# EAGLE design SHASwitchOutput (EAGLE 6.5.0)
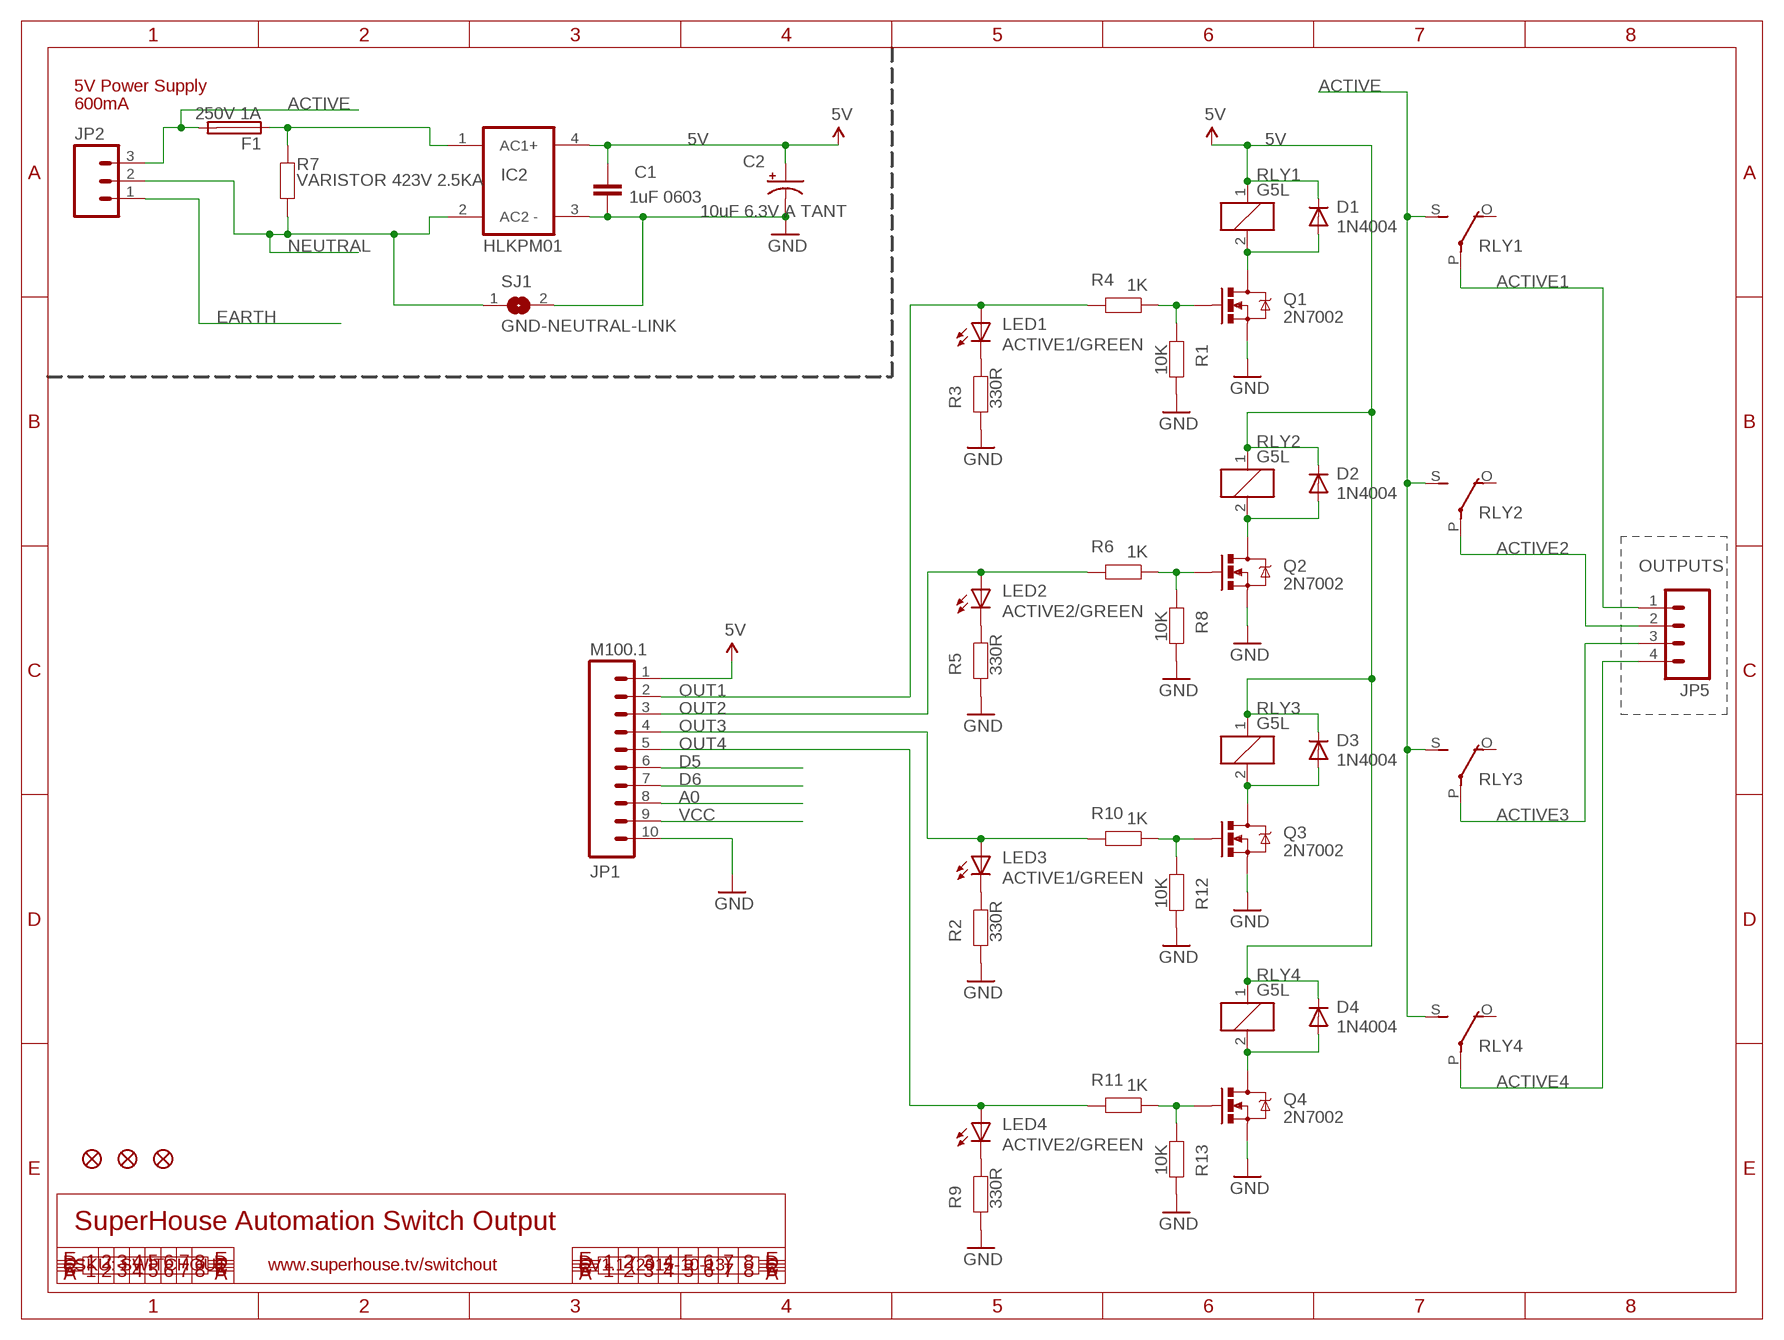
[diagram p0: schematic, sheet 1]

## Parts
C1  1uF 0603  CAP0603  [0603@1]
C2  10uF 6.3V A TANT  CAP_POL1206  [EIA3216]
D1  1N4004  DIODESMB  [SMB-DIODE]
D2  1N4004  DIODESMB  [SMB-DIODE]
D3  1N4004  DIODESMB  [SMB-DIODE]
D4  1N4004  DIODESMB  [SMB-DIODE]
F1  250V 1A  PICOFUSEV  [PICOFUSE-V]
FID1  FIDUCIAL1X2.5  [FIDUCIAL-1X2.5]
FID2  FIDUCIAL1X2.5  [FIDUCIAL-1X2.5]
FID3  FIDUCIAL1X2.5  [FIDUCIAL-1X2.5]
IC2  HLKPM01  [HLKPM01]
JP1  M100.1  [1X10]
JP2  M035MM  [SCREWTERMINAL-5MM-3]
JP5  M045MM  [SCREWTERMINAL-5MM-4]
LED1  ACTIVE1/GREEN  LED0603  [LED-0603]
LED2  ACTIVE2/GREEN  LED0603  [LED-0603]
LED3  ACTIVE1/GREEN  LED0603  [LED-0603]
LED4  ACTIVE2/GREEN  LED0603  [LED-0603]
Q1  2N7002  MOSFET-NCHANNELSMD  [SOT23-3]
Q2  2N7002  MOSFET-NCHANNELSMD  [SOT23-3]
Q3  2N7002  MOSFET-NCHANNELSMD  [SOT23-3]
Q4  2N7002  MOSFET-NCHANNELSMD  [SOT23-3]
R1  10K  RESISTOR0603  [0603]
R2  330R  RESISTOR0603  [0603]
R3  330R  RESISTOR0603  [0603]
R4  1K  RESISTOR0603  [0603]
R5  330R  RESISTOR0603  [0603]
R6  1K  RESISTOR0603  [0603]
R7  VARISTOR 423V 2.5KA  RESISTORPTH1  [AXIAL-0.3]
R8  10K  RESISTOR0603  [0603]
R9  330R  RESISTOR0603  [0603]
R10  1K  RESISTOR0603  [0603]
R11  1K  RESISTOR0603  [0603]
R12  10K  RESISTOR0603  [0603]
R13  10K  RESISTOR0603  [0603]
RLY1  G5L  [G5LE]
RLY2  G5L  [G5LE]
RLY3  G5L  [G5LE]
RLY4  G5L  [G5LE]
SJ1  GND-NEUTRAL-LINK  SJN  [SJ]

## Nets
5V: C1.1 C2.A(+) D1.C D2.C D3.C D4.C IC2.4(+) JP1.1 RLY1.1 RLY2.1 RLY3.1 RLY4.1
$N16: F1.1 IC2.1(AC1) R7.P$2
A0: JP1.8
ACTIVE: F1.2 JP2.3 RLY1.S(2:S) RLY2.S(2:S) RLY3.S(2:S) RLY4.S(2:S)
ACTIVE1: JP5.1 RLY1.P(2:P)
ACTIVE2: JP5.2 RLY2.P(2:P)
ACTIVE3: JP5.3 RLY3.P(2:P)
ACTIVE4: JP5.4 RLY4.P(2:P)
D5: JP1.6
D6: JP1.7
EARTH: JP2.1
GND: C1.2 C2.C(-) IC2.3(-) JP1.10 Q1.2(S) Q2.2(S) Q3.2(S) Q4.2(S) R1.2 R2.1 R3.1 R5.1 R8.2 R9.1 R12.2 R13.2 SJ1.2
N$1: LED3.C R2.2
N$2: LED2.C R5.2
N$3: D2.A Q2.3(D) RLY2.2
N$4: D1.A Q1.3(D) RLY1.2
N$5: Q1.1(G) R1.1 R4.1
N$6: Q2.1(G) R6.1 R8.1
N$9: LED4.C R9.2
N$11: D4.A Q4.3(D) RLY4.2
N$12: D3.A Q3.3(D) RLY3.2
N$13: Q3.1(G) R10.1 R12.1
N$14: Q4.1(G) R11.1 R13.1
N$25: LED1.C R3.2
NEUTRAL: IC2.2(AC2) JP2.2 R7.P$1 SJ1.1
OUT1: JP1.2 LED1.A R4.2
OUT2: JP1.3 LED2.A R6.2
OUT3: JP1.4 LED3.A R10.2
OUT4: JP1.5 LED4.A R11.2
VCC: JP1.9
Unconnected: RLY1.O(2:O) RLY2.O(2:O) RLY3.O(2:O) RLY4.O(2:O)

## Notes on the sheet
- 5V Power Supply
- 600mA
- OUTPUTS
- SuperHouse Automation Switch Output
- SKU: SWITCHOUT | www.superhouse.tv/switchout | V1.1 (2015-10-13)

## Library data of the parts
C1 = freetronics:CAP: Capacitor Standard 0603 ceramic capacitor, and 0.1" leaded capacitor.
C2 = freetronics:CAP_POL: Capacitor Polarized These are standard SMD and PTH capacitors. Normally 10uF, 47uF, and 100uF in electrolytic and tantalum varieties. Always verify the external diameter of the through hole cap, it varies with capacity, voltage, and manufacturer. The EIA devices should be standard.
D1-D4 = freetronics-master-v1.1:DIODE: Diode These are standard reverse protection diodes and small signal diodes. SMA package can handle up to about 1A. SOD-323 can handle about 200mA. What the SOD-323 package when ordering, there are some mfgs out there that are 5-pin packages.
F1 = freetronics-jon:PICOFUSE: PICOFUSE 19275, Wickmann
FID1-FID3 = freetronics:FIDUCIAL: Fiducial Alignment Points Various fiducial points for machine vision alignment.
IC2 = freetronics-jon:HLKPM01
JP1 = freetronics-original:M10: Header 10 Standard 10-pin 0.1" header. Use with straight break away headers (SKU : PRT-00116), right angle break away headers (PRT-00553), swiss pins (PRT-00743), machine pins (PRT-00117), and female headers (PRT-00115).
JP2 = freetronics-jon:M03: Header 3 Standard 3-pin 0.1" header. Use with straight break away headers (SKU : PRT-00116), right angle break away headers (PRT-00553), swiss pins (PRT-00743), machine pins (PRT-00117), and female headers (PRT-00115). Molex polarized connector foot print use with SKU : PRT-08232 with associated crimp pins and housings.
JP5 = freetronics-jon:M04: Header 4 Standard 4-pin 0.1" header. Use with straight break away headers (SKU : PRT-00116), right angle break away headers (PRT-00553), swiss pins (PRT-00743), machine pins (PRT-00117), and female headers (PRT-00115). Molex polarized connector foot print use with SKU : PRT-08231 with associated crimp pins and housings. 1MM SMD Version SKU: PRT-10208
LED1-LED4 = freetronics:LED: LEDs Standard schematic elements and footprints for 5mm, 3mm, 1206, and 0603 sized LEDs. 5mm - Spark Fun Electronics SKU : COM-00529 (and others)
Q1-Q4 = freetronics-master-v1:MOSFET-NCHANNEL
R1-R6 R8-R13 = freetronics:RESISTOR: Resistor Basic schematic elements and footprints for 0603, 1206, and PTH 1/10th watt (small) resistors.
R7 = freetronics-master-v1.1:RESISTOR: Resistor Basic schematic elements and footprints for 0603, 1206, and PTH 1/10th watt (small) resistors.
RLY1-RLY4 = relay:G5L: RELAY 1 x switch, 10 A/120 V AC, 8 A/30 V ADC, Omron; OC_FARNELL: unknown; OC_NEWARK: unknown
SJ1 = freetronics-jon:SJ: SMD solder JUMPER

## Net classes
0 Default: width 0.203 mm
1 VCC: width 0.305 mm

## Board
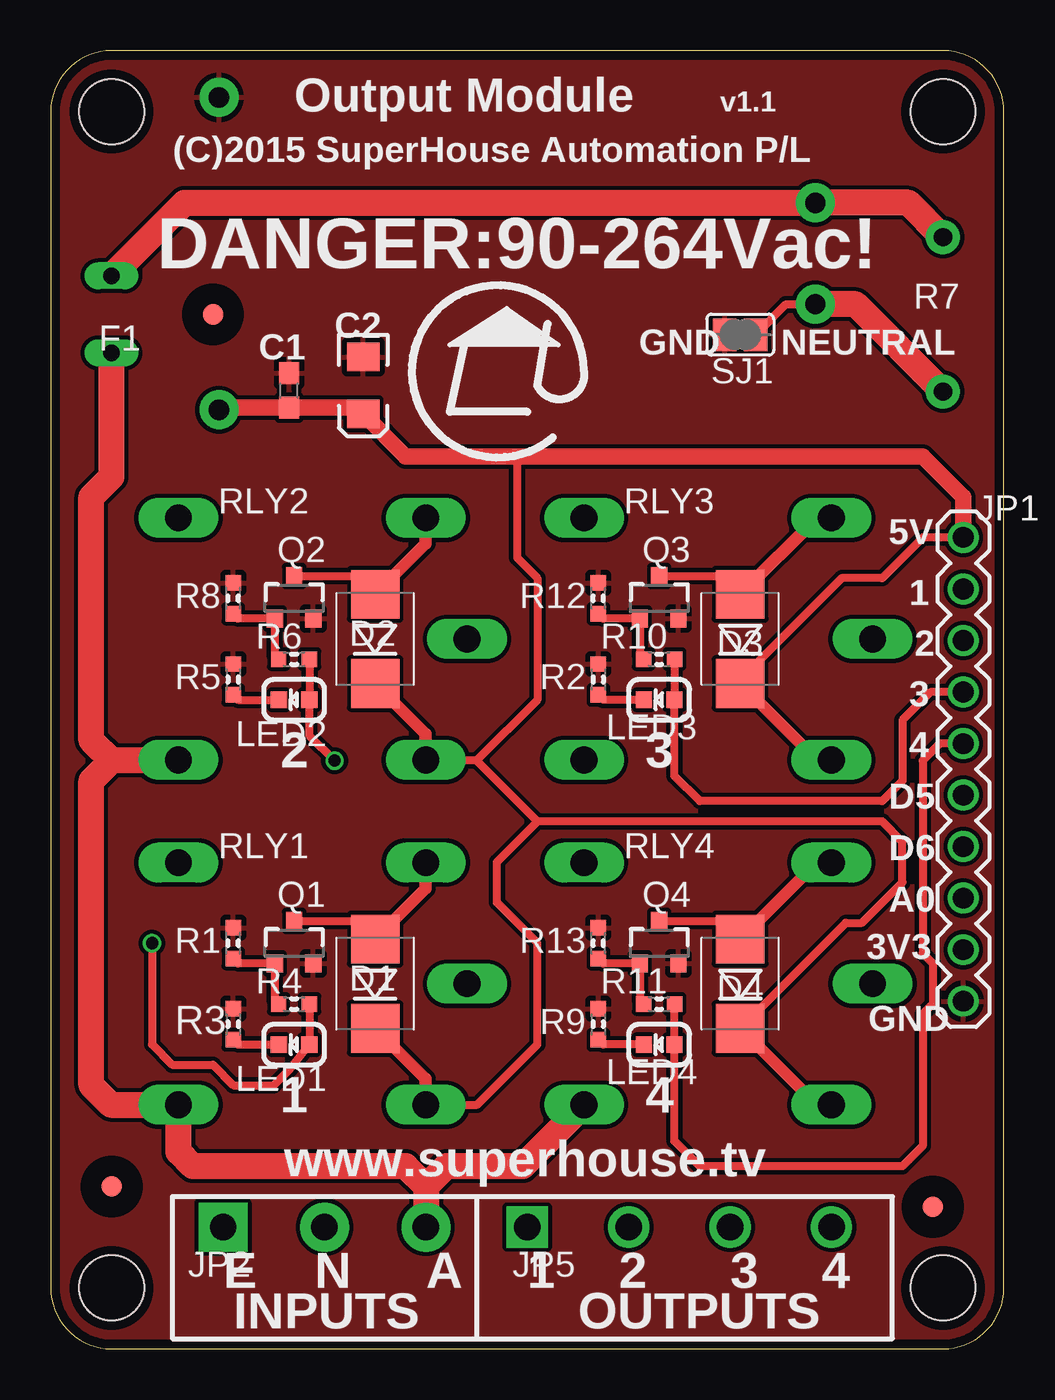
[diagram p1: board, top side]
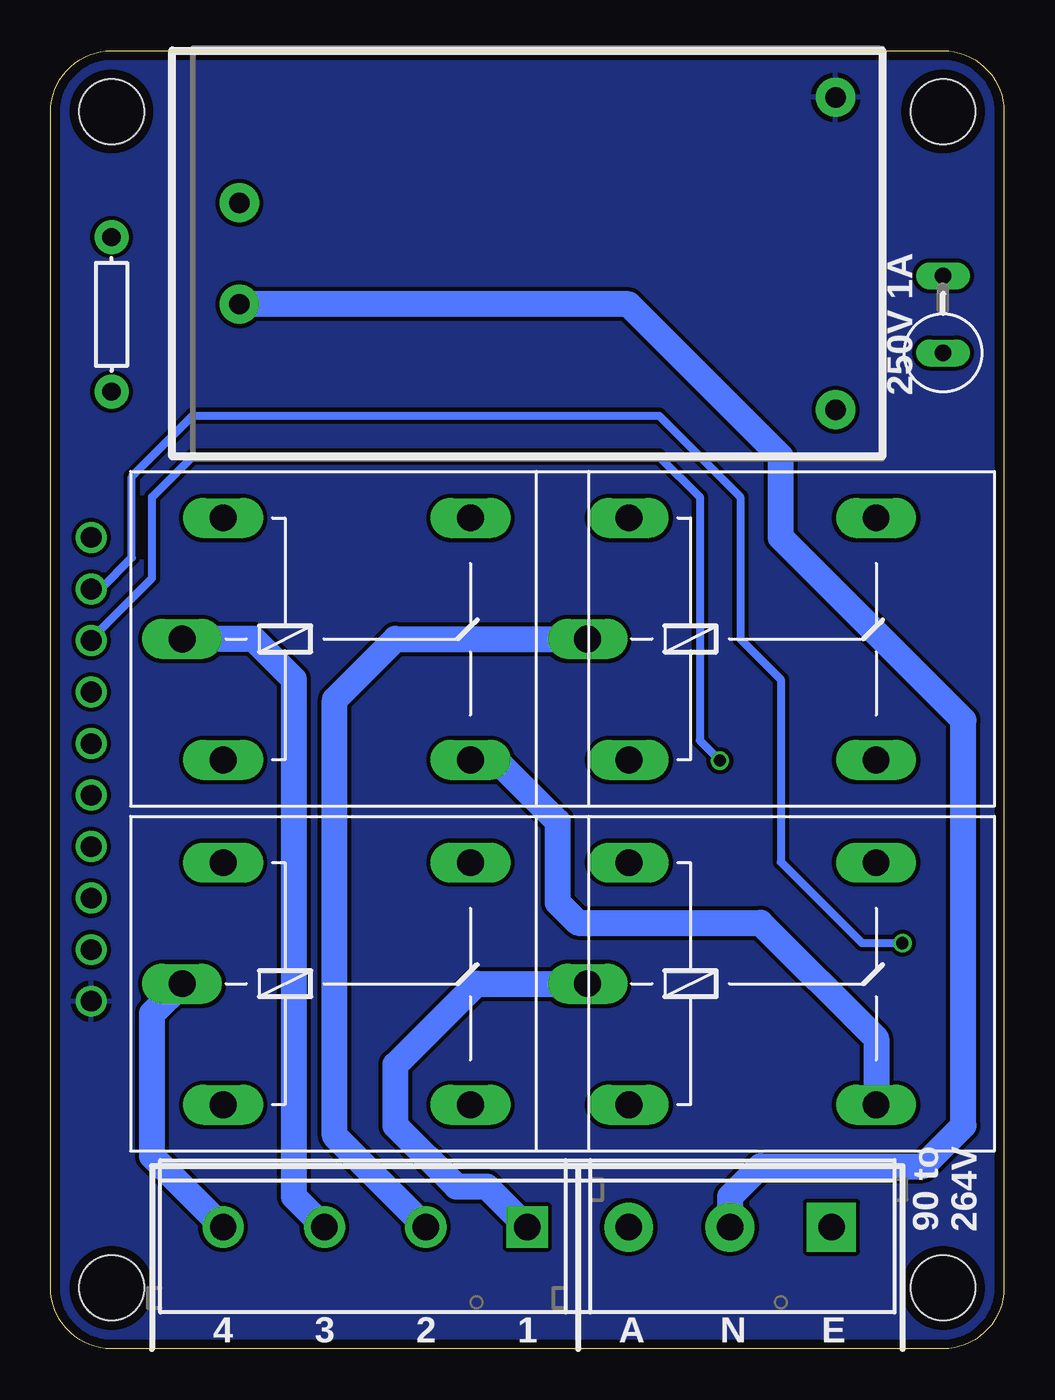
[diagram p2: board, bottom side, seen from below]

Size 47 x 64 mm. Coordinates in mm from the lower left corner, seen from the top.
Outline: 44,64 3,64 arc90 0,61 0,3 arc90 3,0 44,0 arc90 47,3 47,61 arc90 44,64
Copper layers (1*16): Top 0.035mm / dielectric 1.5mm / Bottom 0.035mm
Design rules "default": minimum track width 8mil, minimum drill 15mil, track to track 8mil, track to pad 8mil, pad to pad 8mil, via to via 8mil, smd to smd 8mil, copper to edge 18mil, drill to drill 8mil, minimum pad ring 10mil, minimum via ring 6mil, stop-mask expansion 4mil, vias tented up to drill 25mil, thermal gap 10mil
Holes 3.2 mm at 3,3 44,3 44,61 3,61
tRestrict: area 7,50 to 9,52; area 42.5,6 to 44.5,8; area 2,7 to 4,9

### Footprints (pad centres in the part's own frame; a part is rotated, then mirrored left to right if it is on the bottom)
0603@1 = smd 1.1 x 1: 1 -0.85,0; 2 0.85,0
EIA3216 = smd 1.4 x 1.6: A 1.4,0; C -1.4,0
SMB-DIODE = smd 2.4 x 2.4: A 2.2,0; C -2.2,0
PICOFUSE-V = drill 0.813 long: 1 -1.905,0; 2 1.905,0
FIDUCIAL-1X2.5 = smd 1 x 1: 1 0,0
HLKPM01 = drill 1 pad 1.93: 1 -14.7,2.5; 2 -14.7,-2.5; 3 14.7,7.7; 4 14.7,-7.7
1X10 = drill 1.016: 1 0,0; 2 2.54,0; 3 5.08,0; 4 7.62,0; 5 10.16,0; 6 12.7,0; 7 15.24,0; 8 17.78,0; 9 20.32,0; 10 22.86,0
SCREWTERMINAL-5MM-3 = drill 1.3 pad 2.413 square: 1 0,0 | drill 1.3 pad 2.413: 2 5,0; 3 10,0
SCREWTERMINAL-5MM-4 = drill 1.3 pad 2.032 square: 1 0,0 | drill 1.3 pad 2.032: 2 5,0; 3 10,0; 4 15,0
LED-0603 = smd 0.8 x 0.8: A 0,-0.75; C 0,0.75
SOT23-3 = smd 0.8 x 0.9: 1 -0.95,-1; 2 0.95,-1; 3 0,1.1
0603 = smd 0.762 x 0.762: 1 -0.762,0; 2 0.762,0
AXIAL-0.3 = drill 0.9 pad 1.676: P$1 -3.81,0; P$2 3.81,0
G5LE = drill 1.321 long: 1 -7.493,-5.969; 2 -7.493,5.969; O 4.699,5.969; P -9.525,0; S 4.699,-5.969
SJ = smd 1.168 x 1.6: 1 -0.762,0; 2 0.762,0

### Placement (x,y rotation side)
C1  11.76,47.25 90 top
C2  15.41,47.5 270 top
D1  16,18 90 top
D2  16,35 90 top
D3  34,35 90 top
D4  34,18 90 top
F1  3,51 270 bottom
FID1  8,51 180 top
FID2  43.5,7 180 top
FID3  3,8 180 top
IC2  23,54 0 bottom
JP1  45,40 270 top
JP2  8.5,6 180 bottom
JP5  23.5,6 180 bottom
LED1  12,15 90 top
LED2  12,32 90 top
LED3  30,32 90 top
LED4  30,15 90 top
Q1  12,20 0 top
Q2  12,37 0 top
Q3  30,37 0 top
Q4  30,20 0 top
R1  9,20 90 top
R2  27,33 270 top
R3  9,16 270 top
R4  12,17 0 top
R5  9,33 270 top
R6  12,34 0 top
R7  44,51 90 bottom
R8  9,37 90 top
R9  27,16 270 top
R10  30,34 0 top
R11  30,17 0 top
R12  27,37 90 top
R13  27,20 90 top
RLY1  11,18 0 bottom
RLY2  11,35 0 bottom
RLY3  31,35 0 bottom
RLY4  31,18 0 bottom
SJ1  34,50 180 top

### Tracks (layer width: path | path; a pad name or v marks a point on that pad's centre or on a via)
5V
  Top 0.406: RLY1.1 21.03,12.03 24,15 24,20 22,22 22,24 24,26 | 24,26 21,29 | 21,29 18.52,29 | 23,44 23,39 24,38 24,32 21,29 | JP1.1 43,40 41,38 39,38 34,33 | D4.C 39.2,21 40,21 42,23 42,25 41,26 24,26
  Top 0.61: 34,15.52 D4.C 37.77,12.03 RLY4.1 | 18.52,29 RLY2.1 18.49,30.31 D2.C | 34,33 D3.C 37.77,29.03 RLY3.1 | RLY1.1 18.49,13.31 D1.C
  Top 0.813: JP1.1 45,42 43,44 23,44 17.51,44 C2.A 15.11,46.4 C1.1 8.4,46.4 IC2.4
$N16
  Top 1.27: R7.P$2 42.31,56.5 IC2.1 6.59,56.5 F1.1
ACTIVE
  Top 1.27: 6.27,29 RLY2.S 3.03,29.03 3,29 | RLY4.S 23.27,9 19.5,9 18.5,8 | 18.5,8 17.5,9 7,9 6.3,9.7 RLY1.S 2.97,12.03 2,13 2,28 3,29 | 18.5,8 JP2.3 | 3,29 2,30 2,42 3,43 F1.2
  Bottom 1.27: RLY3.S 25.03,29.03 22,26 22,22 21,21 12,21 6.3,15.3 RLY1.S
ACTIVE1
  Bottom 1.27: RLY1.P 26,18 30,14 30,11 27,8 25.5,8 JP5.1
ACTIVE2
  Bottom 1.27: RLY2.P 30,35 33,32 33,10.5 JP5.2
ACTIVE3
  Bottom 1.27: RLY3.P 37,35 35,33 35,7.5 JP5.3
ACTIVE4
  Bottom 1.27: RLY4.P 42,16.52 42,9.5 JP5.4
GND
  pour Bottom: 44,0 3,0 arc-90 0,3 0,61 arc-90 3,64 44,64 arc-90 47,61 47,3 arc-90
  pour Top: 44,0 3,0 arc-90 0,3 0,61 arc-90 3,64 44,64 arc-90 47,61 47,3 arc-90
N$1
  Top 0.406: LED3.C 27.24,32 R2.2
N$2
  Top 0.406: R5.2 9.24,32 LED2.C
N$3
  Top 0.406: Q2.3 15.1,38.1 D2.A
  Top 0.61: RLY2.2 18.49,39.69 D2.A
N$4
  Top 0.406: Q1.3 15.1,21.1 D1.A
  Top 0.61: RLY1.2 18.49,22.69 D1.A
N$5
  Top 0.406: R4.1 11.05,17.19 Q1.1 9.24,19 R1.1
N$6
  Top 0.406: R6.1 11.05,34.19 Q2.1 9.24,36 R8.1
N$9
  Top 0.406: LED4.C 27.24,15 R9.2
N$11
  Top 0.406: Q4.3 33.1,21.1 D4.A
  Top 0.61: RLY4.2 37.77,23.97 D4.A
N$12
  Top 0.406: Q3.3 33.1,38.1 D3.A
  Top 0.61: RLY3.2 37.77,40.97 D3.A
N$13
  Top 0.406: R12.1 27.24,36 Q3.1 29.05,34.19 R10.1
N$14
  Top 0.406: R11.1 29.05,17.19 Q4.1 27.24,19 R13.1
N$25
  Top 0.406: R3.2 9.24,15 LED1.C
NEUTRAL
  Top 0.406: SJ1.1 36.26,51.5 IC2.2
  Top 1.27: R7.P$1 39.69,51.5 IC2.2
  Bottom 1.27: JP2.2 13.5,7.5 12,9 4,9 2,11 2,31 11,40 11,44 18.5,51.5 IC2.2
OUT1  (via drill 0.6)
  Top 0.406: R4.2 12.76,15.01 LED1.A 11.75,13.75 11,13 9,13 8,14 6,14 5,15 v5,20
  Bottom 0.406: 44.54,37.46 43,39 43,43 40,46 17,46 13,42 13,35 11,33 11,24 7,20 v5,20
  Bottom 0.61: JP1.2 44.54,37.46
OUT2  (via drill 0.6)
  Top 0.406: R6.2 12.76,32.01 LED2.A 12.75,30.25 v14,29
  Bottom 0.406: 45,35 42,38 42,42 40,44 17,44 15,42 15,30 v14,29
  Bottom 0.61: JP1.3 45,35
OUT3
  Top 0.406: R10.2 30.76,32.01 LED3.A 30.75,28.25 32,27 41,27 42,28 42,31 43.38,32.38 JP1.4
OUT4
  Top 0.406: R11.2 30.75,16.99 LED4.A 30.75,10.25 32,9 42,9 43,10 43,16.5 43.5,17 43.5,19 43,19.5 43,29 43.84,29.84 JP1.5

### Text on the board
tPlace: Output Module | v1.1 | (C)2015 SuperHouse Automation P/L | DANGER:90-264Vac! | GND | NEUTRAL | 5V | 1 | 2 | 3 | 2 | 3 | 4 | D5 | D6 | A0 | 3V3 | GND | 1 | 4 | www.superhouse.tv | E | N | A | 1 | 2 | 3 | 4 | INPUTS | OUTPUTS
bPlace: 250V 1A | 90 to / 264V | E | N | A | 1 | 2 | 3 | 4
tDocu: 4 x 330R 0603 / 4 x 1K 0603 / 4 x 10K 0603 / 4 x 1N4004 SMA / 1 x 1uF 0603 / 1 x 10uF 6.3V TANT / 4 x 2N7002 / 4 x GREEN LED / 1 x 250V 1A FUSE / 1 x 423V 2.5KA VARISTOR / 4 x RELAY